# Altium project MicrophoneArray.PrjPcb
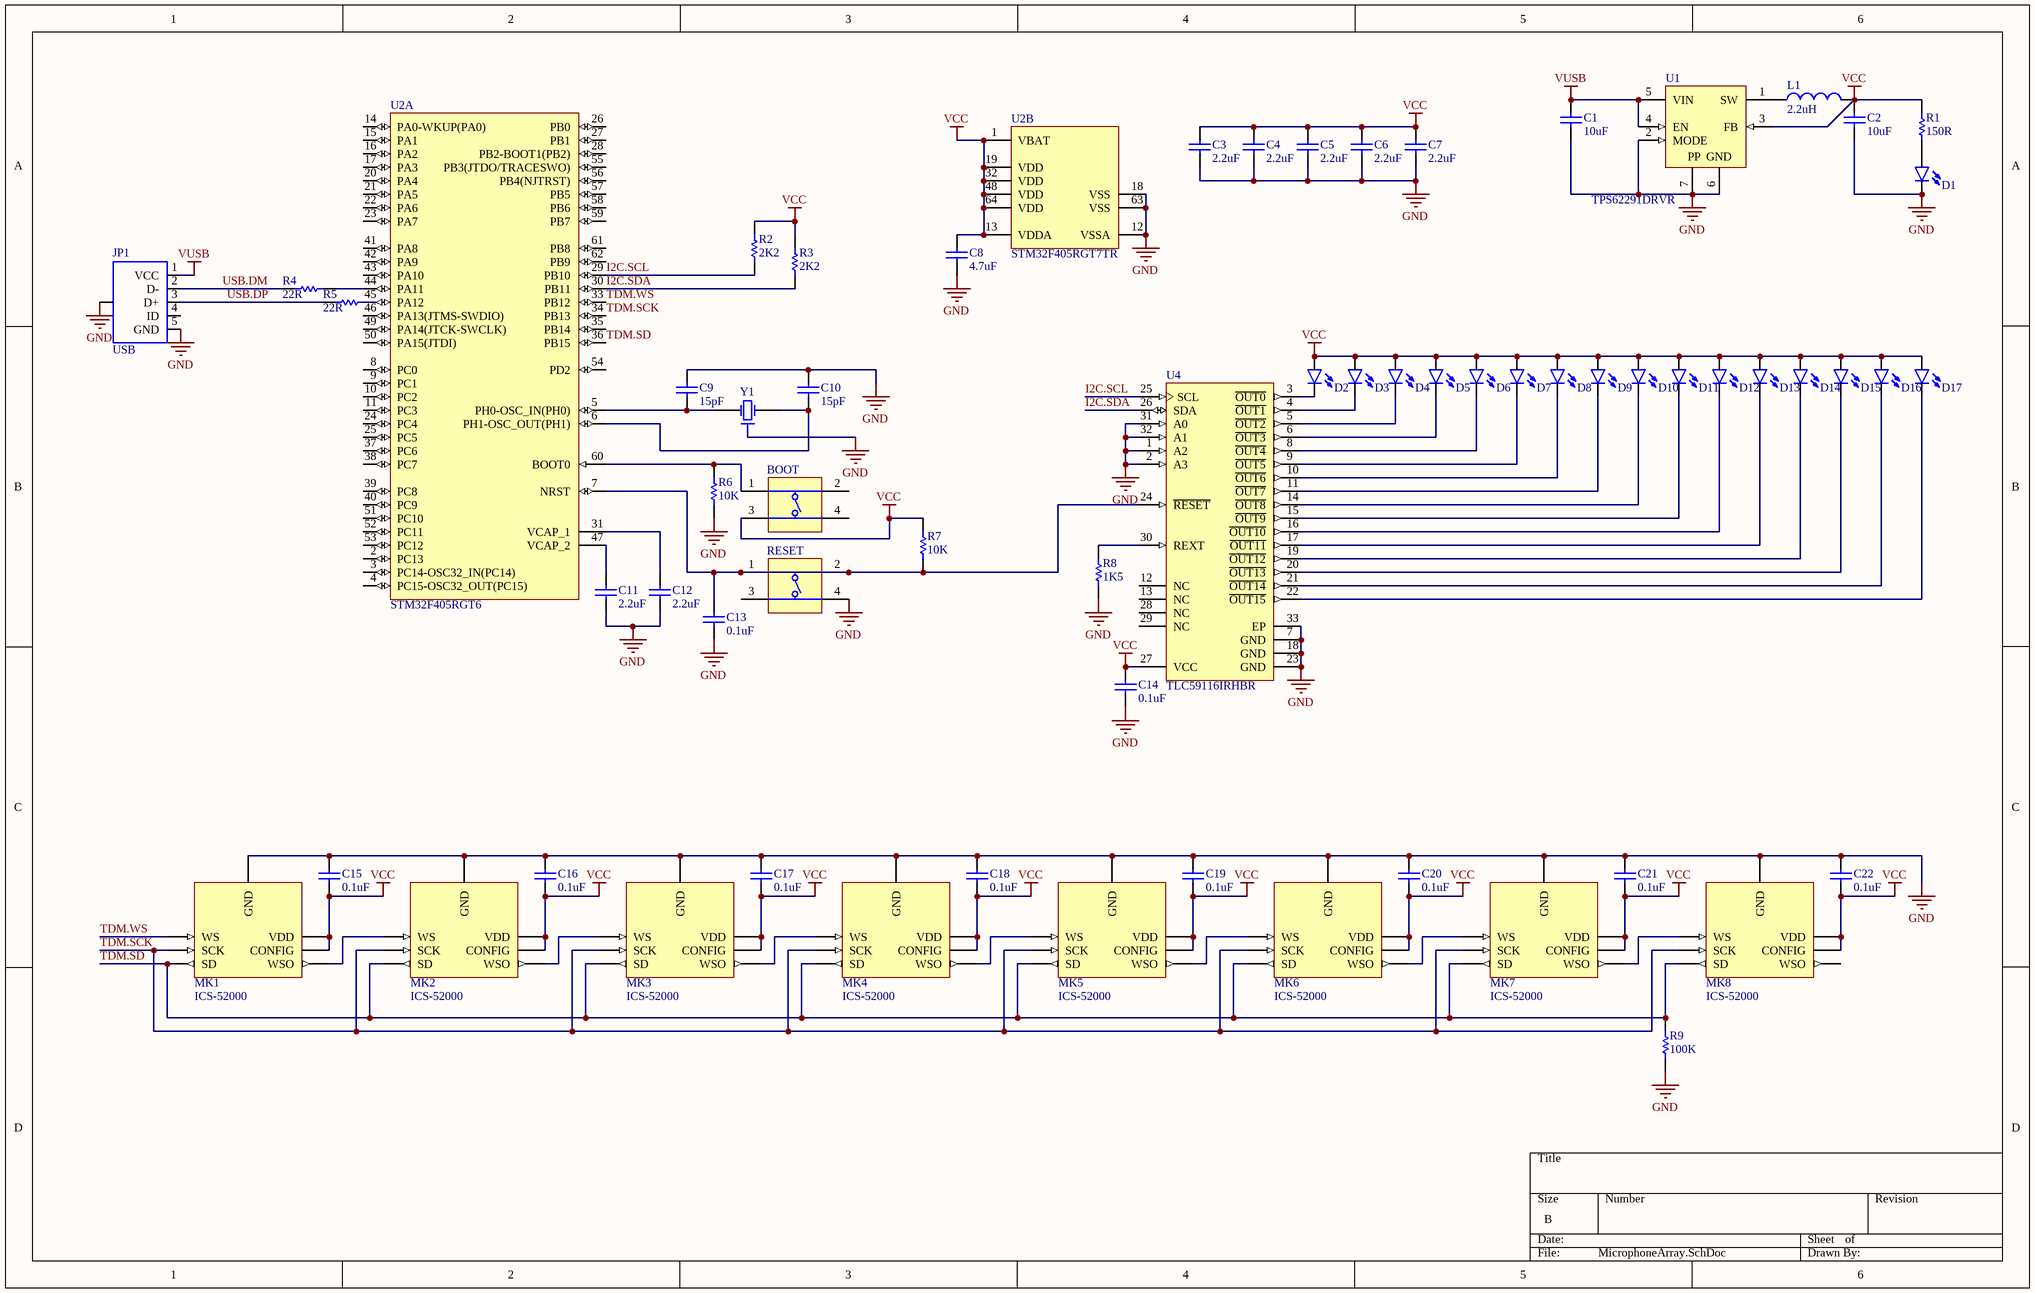
[diagram p0: MicrophoneArray.SchDoc]
1 sheet, 64 parts. Net scope: global (net labels, ports and power ports of the same name join across sheets).
Board file: MicrophoneArray.PcbDoc

## Sheet MicrophoneArray.SchDoc
size B

### Parts
BOOT  (no value)  [SWITCH]
C1  value 10uF  [C0402[1005X55]]  (hidden comment: 10uF 6.3V 0402)
C2  value 10uF  [C0402[1005X55]]  (hidden comment: 10uF 6.3V 0402)
C3  value 2.2uF  [C0402[1005X55]]  (hidden comment: 2.2uF 6.3V 0402)
C4  value 2.2uF  [C0402[1005X55]]  (hidden comment: 2.2uF 6.3V 0402)
C5  value 2.2uF  [C0402[1005X55]]  (hidden comment: 2.2uF 6.3V 0402)
C6  value 2.2uF  [C0402[1005X55]]  (hidden comment: 2.2uF 6.3V 0402)
C7  value 2.2uF  [C0402[1005X55]]  (hidden comment: 2.2uF 6.3V 0402)
C8  value 4.7uF  [C0402[1005X55]]  (hidden comment: 4.7uF 6.3V 0402)
C9  value 15pF  [C0402[1005X55]]  (hidden comment: 15pF 50V 0402)
C10  value 15pF  [C0402[1005X55]]  (hidden comment: 15pF 50V 0402)
C11  value 2.2uF  [C0402[1005X55]]  (hidden comment: 2.2uF 6.3V 0402)
C12  value 2.2uF  [C0402[1005X55]]  (hidden comment: 2.2uF 6.3V 0402)
C13  value 0.1uF  [C0402[1005X55]]  (hidden comment: 0.1uF 6.3V 0402)
C14  value 0.1uF  [C0402[1005X55]]  (hidden comment: 0.1uF 6.3V 0402)
C15  value 0.1uF  [C0402[1005X55]]  (hidden comment: 0.1uF 6.3V 0402)
C16  value 0.1uF  [C0402[1005X55]]  (hidden comment: 0.1uF 6.3V 0402)
C17  value 0.1uF  [C0402[1005X55]]  (hidden comment: 0.1uF 6.3V 0402)
C18  value 0.1uF  [C0402[1005X55]]  (hidden comment: 0.1uF 6.3V 0402)
C19  value 0.1uF  [C0402[1005X55]]  (hidden comment: 0.1uF 6.3V 0402)
C20  value 0.1uF  [C0402[1005X55]]  (hidden comment: 0.1uF 6.3V 0402)
C21  value 0.1uF  [C0402[1005X55]]  (hidden comment: 0.1uF 6.3V 0402)
C22  value 0.1uF  [C0402[1005X55]]  (hidden comment: 0.1uF 6.3V 0402)
D1  LED_0603_GREEN_5mA  [LED0603]  (value not drawn)
D2  LED_0603_BLUE_5mA  [LED0603]  (value not drawn)
D3  LED_0603_BLUE_5mA  [LED0603]  (value not drawn)
D4  LED_0603_BLUE_5mA  [LED0603]  (value not drawn)
D5  LED_0603_BLUE_5mA  [LED0603]  (value not drawn)
D6  LED_0603_BLUE_5mA  [LED0603]  (value not drawn)
D7  LED_0603_BLUE_5mA  [LED0603]  (value not drawn)
D8  LED_0603_BLUE_5mA  [LED0603]  (value not drawn)
D9  LED_0603_BLUE_5mA  [LED0603]  (value not drawn)
D10  LED_0603_BLUE_5mA  [LED0603]  (value not drawn)
D11  LED_0603_BLUE_5mA  [LED0603]  (value not drawn)
D12  LED_0603_BLUE_5mA  [LED0603]  (value not drawn)
D13  LED_0603_BLUE_5mA  [LED0603]  (value not drawn)
D14  LED_0603_BLUE_5mA  [LED0603]  (value not drawn)
D15  LED_0603_BLUE_5mA  [LED0603]  (value not drawn)
D16  LED_0603_BLUE_5mA  [LED0603]  (value not drawn)
D17  LED_0603_BLUE_5mA  [LED0603]  (value not drawn)
JP1  USB  [USB-MICROB]
L1  2.2uH  [IND0805]
MK1  ICS-52000  [MIC]
MK2  ICS-52000  [MIC]
MK3  ICS-52000  [MIC]
MK4  ICS-52000  [MIC]
MK5  ICS-52000  [MIC]
MK6  ICS-52000  [MIC]
MK7  ICS-52000  [MIC]
MK8  ICS-52000  [MIC]
R1  value 150R  [R0402[1005]]  (hidden comment: 150R 1% 0402)
R2  value 2K2  [R0402[1005]]  (hidden comment: 2K2 1% 0402)
R3  value 2K2  [R0402[1005]]  (hidden comment: 2K2 1% 0402)
R4  value 22R  [R0402[1005]]  (hidden comment: 22R 1% 0402)
R5  value 22R  [R0402[1005]]  (hidden comment: 22R 1% 0402)
R6  value 10K  [R0402[1005]]  (hidden comment: 10K 1% 0402)
R7  value 10K  [R0402[1005]]  (hidden comment: 10K 1% 0402)
R8  value 1K5  [R0402[1005]]  (hidden comment: 1K5 1% 0402)
R9  value 100K  [R0402[1005]]  (hidden comment: 100K 1% 0402)
RESET  (no value)  [SWITCH]
U1  TPS62291DRVR  [WSON-6]
U2  STM32F405RGT6  [STM-LQFP64_L]  (parts A,B of 2)
U4  TLC59116IRHBR  [RHB0032E_V]
Y1  (no value)  [ABRA-ABM3B-4_V]

### Nets
GND: C1.1 C2.1 C3.1 C4.1 C5.1 C6.1 C7.1 C8.1 C9.2 C10.2 C11.1 C12.1 C13.1 C14.1 C15.2 C16.2 C17.2 C18.2 C19.2 C20.2 C21.2 C22.2 D1.C JP1.5(GND) JP1.6(SHIELD) MK1.4(GND) MK2.4(GND) MK3.4(GND) MK4.4(GND) MK5.4(GND) MK6.4(GND) MK7.4(GND) MK8.4(GND) R6.1 R8.1 R9.1 RESET.4(T3) U1.2(MODE) U1.6(GND) U1.7(EP) U2.12(VSSA) U2.18(VSS) U2.63(VSS) U4.1(A2) U4.2(A3) U4.7(GND) U4.18(GND) U4.23(GND) U4.31(A0) U4.32(A1) U4.33(EP) Y1.2
VCC: BOOT.3(T3) C2.2 C3.2 C4.2 C5.2 C6.2 C7.2 C8.2 C14.2 C15.1 C16.1 C17.1 C18.1 C19.1 C20.1 C21.1 C22.1 D2.A D3.A D4.A D5.A D6.A D7.A D8.A D9.A D10.A D11.A D12.A D13.A D14.A D15.A D16.A D17.A L1.2 MK1.2(CONFIG) MK1.3(VDD) MK2.2(CONFIG) MK2.3(VDD) MK3.2(CONFIG) MK3.3(VDD) MK4.2(CONFIG) MK4.3(VDD) MK5.2(CONFIG) MK5.3(VDD) MK6.2(CONFIG) MK6.3(VDD) MK7.2(CONFIG) MK7.3(VDD) MK8.2(CONFIG) MK8.3(VDD) R1.2 R2.2 R3.2 R7.2 U1.3(FB) U2.1(VBAT) U2.13(VDDA) U2.19(VDD) U2.32(VDD) U2.48(VDD) U2.64(VDD) U4.27(VCC)
VUSB: C1.2 JP1.1(VCC) U1.4(EN) U1.5(VIN)
I2C.SCL: R2.1 U2.29(PB10) U4.25(SCL)
I2C.SDA: R3.1 U2.30(PB11) U4.26(SDA)
TDM.SCK: MK1.6(SCK) MK2.6(SCK) MK3.6(SCK) MK4.6(SCK) MK5.6(SCK) MK6.6(SCK) MK7.6(SCK) MK8.6(SCK) U2.34(PB13)
TDM.SD: MK1.7(SD) MK2.7(SD) MK3.7(SD) MK4.7(SD) MK5.7(SD) MK6.7(SD) MK7.7(SD) MK8.7(SD) R9.2 U2.36(PB15)
TDM.WS: MK1.5(WS) U2.33(PB12)
USB.DM: JP1.2(D-) R4.1
USB.DP: JP1.3(D+) R5.1
NetBOOT_1: BOOT.1(T1) R6.2 U2.60(BOOT0)
NetC9_1: C9.1 U2.5(PH0-OSC_IN(PH0)) Y1.3(X2)
NetC10_1: C10.1 U2.6(PH1-OSC_OUT(PH1)) Y1.1(X1)
NetC11_2: C11.2 U2.47(VCAP_2)
NetC12_2: C12.2 U2.31(VCAP_1)
NetC13_2: C13.2 R7.1 RESET.1(T1) RESET.2(T2) U2.7(NRST) U4.24(~{RESET})
NetD1_A: D1.A R1.1
NetD2_C: D2.C U4.3(~{OUT0})
NetD3_C: D3.C U4.4(~{OUT1})
NetD4_C: D4.C U4.5(~{OUT2})
NetD5_C: D5.C U4.6(~{OUT3})
NetD6_C: D6.C U4.8(~{OUT4})
NetD7_C: D7.C U4.9(~{OUT5})
NetD8_C: D8.C U4.10(~{OUT6})
NetD9_C: D9.C U4.11(~{OUT7})
NetD10_C: D10.C U4.14(~{OUT8})
NetD11_C: D11.C U4.15(~{OUT9})
NetD12_C: D12.C U4.16(~{OUT10})
NetD13_C: D13.C U4.17(~{OUT11})
NetD14_C: D14.C U4.19(~{OUT12})
NetD15_C: D15.C U4.20(~{OUT13})
NetD16_C: D16.C U4.21(~{OUT14})
NetD17_C: D17.C U4.22(~{OUT15})
NetL1_1: L1.1 U1.1(SW)
NetMK1_1: MK1.1(WSO) MK2.5(WS)
NetMK2_1: MK2.1(WSO) MK3.5(WS)
NetMK3_1: MK3.1(WSO) MK4.5(WS)
NetMK4_1: MK4.1(WSO) MK5.5(WS)
NetMK5_1: MK5.1(WSO) MK6.5(WS)
NetMK6_1: MK6.1(WSO) MK7.5(WS)
NetMK7_1: MK7.1(WSO) MK8.5(WS)
NetR4_2: R4.2 U2.44(PA11)
NetR5_2: R5.2 U2.45(PA12)
NetR8_2: R8.2 U4.30(REXT)

Not connected (* = marked no-connect by the designer): BOOT 2(T2) 4(T3); JP1 4(ID); MK8 1(WSO); RESET 3(T3); U2 2(PC13) 3(PC14-OSC32_IN(PC14)) 4(PC15-OSC32_OUT(PC15)) 8(PC0) 9(PC1) 10(PC2) 11(PC3) 14(PA0-WKUP(PA0)) 15(PA1) 16(PA2) 17(PA3) 20(PA4) 21(PA5) 22(PA6) 23(PA7) 24(PC4) 25(PC5) 26(PB0) 27(PB1) 28(PB2-BOOT1(PB2)) 35(PB14) 37(PC6) 38(PC7) 39(PC8) 40(PC9) 41(PA8) 42(PA9) 43(PA10) 46(PA13(JTMS-SWDIO)) 49(PA14(JTCK-SWCLK)) 50(PA15(JTDI)) 51(PC10) 52(PC11) 53(PC12) 54(PD2) 55(PB3(JTDO/TRACESWO)) 56(PB4(NJTRST)) 57(PB5) 58(PB6) 59(PB7) 61(PB8) 62(PB9); U4 12(NC) 13(NC) 28(NC) 29(NC)

### Notes on the sheet
- (in symbol TPS62291DRVR) PP

### Library data of the parts
BOOT RESET = DIPT-DTSM-6: Switch, SPNO Push Button SMD; Manufacturer: C&K Components; PartNumber: PTS810 SJM 250 SMTR LFS; Packing Type: Tape&Reel; Mechanical Life: 200,000 cycles; ComponentLink2URL: http://www.dip.com.tw/Products_tact.htm; ComponentLink1URL: http://www.dip.com.tw/; ComponentLink3URL: http://www.dip.com.tw/PDF/pro_tact/DTSM_G_-6_2_-V.pdf; PackageDescription: Switch, Surface Mount, 4 Leads, Body 4.6x2.8mm, Height 1.9mm; ComponentLink2Description: Datasheet; ComponentLink3Description: Package Specification; ComponentLink1Description: Manufacturer URL; PackageReference: PTS810; Mounting Technology: Surface Mount
C1 C2 = CAP_10uF_6.3V_0402_20%: 10uF 6.3V 20% 0402 (1005 Metric); PartNumber: GRM155R60J106ME44D; Manufacturer: Murata; Tolerance: 20%; Mounting Technology: Surface Mount; PackageReference: 0402; PackageDescription: 0402 (1005 Metric); Voltage: 6.3V
C3-C7 C11 C12 = CAP_2.2uF_6.3V_0402_20%: 2.2uF 6.3V 20% 0402 (1005 Metric); PartNumber: GRM155R60J225ME15D; Manufacturer: Murata; Tolerance: 20%; Mounting Technology: Surface Mount; PackageReference: 0402; PackageDescription: 0402 (1005 Metric); Voltage: 6.3V
C8 = CAP_4.7uF_6.3V_0402_20%: 4.7uF 6.3V 20% 0402 (1005 Metric); PartNumber: GRM155R60J475ME47D; Manufacturer: Murata; Tolerance: 20%; Mounting Technology: Surface Mount; PackageReference: 0402; PackageDescription: 0402 (1005 Metric); Voltage: 6.3V
C9 C10 = CAP_15pF_50V_0402_5%: 15pF 50V 5% 0402 (1005 Metric); PartNumber: GRM1555C1H150JA01D; Manufacturer: Murata; Tolerance: 5%; Mounting Technology: Surface Mount; PackageReference: 0402; PackageDescription: 0402 (1005 Metric); Voltage: 50V
C13-C22 = CAP_0.1uF_6.3V_0402_10%: 0.1uF 6.3V 10% 0402 (1005 Metric); PartNumber: GRM155R70J104KA01D; Manufacturer: Murata; Tolerance: 10%; Mounting Technology: Surface Mount; PackageReference: 0402; PackageDescription: 0402 (1005 Metric); Voltage: 6.3V
D1 = LED_0603_GREEN_5mA: PartNumber: LTST-C193TGKT-5A; Manufacturer: Lite-On Inc.; PackageReference: 0603; PackageDescription: 0603 (1608 Metric); Mounting Technology: Surface Mount
D2-D17 = LED_0603_BLUE_5mA: PartNumber: LTST-C193TBKT-5A; Manufacturer: Lite-On Inc.; PackageReference: 0603; PackageDescription: 0603 (1608 Metric); Mounting Technology: Surface Mount
JP1 = USB_MICROB_SMT: pin to pad: 1>VBUS 2>D- 3>D+ 4>ID 5>GND 6>MT1+P$1+P$2+MT2; PartNumber: 10118192-0001LF; Manufacturer: Amphenol FCI; Mounting Technology: Surface Mount; PackageReference: USB - Micro B
L1 = IND_2.2uH_1.7A_0805_20%: 2.2uH 20% 1.7A 0805; PartNumber: LQM21PN2R2MGHL; Manufacturer: Murata; PackageReference: 0805; PackageDescription: 0805 (2012 metric); Value: 2.2uH; Mounting Technology: Surface Mount; Current: 1.7A
MK1-MK8 = ICS-52000: MIC MEMS DIGITAL OMNI -26DB; Manufacturer: TDK InvenSense; PartNumber: ICS-52000; Mounting Technology: Surface Mount
R1 = RES_150R_0402_1%: 150R 0.063W 1% 0402 (1005 Metric); Manufacturer: KOA Speer; PartNumber: RK73H1ETTP1500F; Tolerance: 1%; Power: 0.063W; Mounting Technology: Surface Mount; PackageReference: 0402; PackageDescription: 0402 (1005 Metric); ComponentLink1Description: Datasheet; ComponentLink1URL: http://www.koaspeer.com/catimages/Products/RK73H/RK73H.pdf
R2 R3 = RES_2K2_0402_1%: 2K2 0.063W 1% 0402 (1005 Metric); Manufacturer: KOA Speer; PartNumber: RK73H1ETTP2201F; Tolerance: 1%; Power: 0.063W; Mounting Technology: Surface Mount; PackageReference: 0402; PackageDescription: 0402 (1005 Metric); ComponentLink1Description: Datasheet; ComponentLink1URL: http://www.koaspeer.com/catimages/Products/RK73H/RK73H.pdf
R4 R5 = RES_22R_0402_1%: 22R 0.063W 1% 0402 (1005 Metric); Manufacturer: KOA Speer; PartNumber: RK73H1ETTP22R0F; Power: 0.063W; Tolerance: 1%; Mounting Technology: Surface Mount; PackageReference: 0402; PackageDescription: 0402 (1005 Metric); ComponentLink1Description: Datasheet; ComponentLink1URL: http://www.koaspeer.com/catimages/Products/RK73H/RK73H.pdf
R6 R7 = RES_10K_0402_1%: 10K 0.063W 1% 0402 (1005 Metric); Manufacturer: KOA Speer; PartNumber: RK73H1ETTP1002F; Tolerance: 1%; Power: 0.063W; Mounting Technology: Surface Mount; PackageReference: 0402; PackageDescription: 0402 (1005 Metric); ComponentLink1Description: Datasheet; ComponentLink1URL: http://www.koaspeer.com/catimages/Products/RK73H/RK73H.pdf
R8 = RES_1K5_0402_1%: 1K5 0.063W 1% 0402 (1005 Metric); Manufacturer: KOA Speer; PartNumber: RK73H1ETTP1501F; Tolerance: 1%; Power: 0.063W; Mounting Technology: Surface Mount; PackageReference: 0402; PackageDescription: 0402 (1005 Metric); ComponentLink1Description: Datasheet; ComponentLink1URL: http://www.koaspeer.com/catimages/Products/RK73H/RK73H.pdf
R9 = RES_100K_0402_1%: 100K 0.063W 1% 0402 (1005 Metric); Manufacturer: KOA Speer; PartNumber: RK73H1ETTP1003F; Tolerance: 1%; Power: 0.063W; Mounting Technology: Surface Mount; PackageReference: 0402; PackageDescription: 0402 (1005 Metric); ComponentLink1Description: Datasheet; ComponentLink1URL: http://www.koaspeer.com/catimages/Products/RK73H/RK73H.pdf
U1 = TPS62291DRVR: Voltage Regulators - Switching Regulators 2.25MHz 1A Step-Down Cnvrtr 3.3V Output; Manufacturer: Texas Instruments; PartNumber: TPS62291DRVR; PackageReference: WSON-6; PackageDescription: SON, 6-Leads, Body 2x2mm, Pitch 0.65mm, Thermal Pad 1.6x1mm, TI Recommended; Mounting Technology: Surface Mount
U2 = CMP-0243-00089-2: ARM Cortex-M4 32-bit MCU+FPU, 210 DMIPS, 1024 kB Flash, 192 kB Internal RAM, 51 I/Os, 64-pin LQFP, -40 to 105 degC, Tape and Reel; Manufacturer: STMicroelectronics; FLASH Size (Prog) (kB): 1024; Supply Voltage(Vcc) max (V): 3.6; Internal RAM Size (kB): 192; Supply Voltage(Vcc) min (V): 1.8; Operating Frequency(F) (Processor speed) (MHz): 168; D/A Converter: 2x12-bit; I/Os (High Current): 51; ComponentLink2Description: Datasheet; Core: ARM Cortex-M4; PackageVersion: Rev. 4, 06/2013; ComponentLink1URL: http://www.st.com/web/en/home.html; PackageReference: LQFP64; Mounting Technology: Surface Mount; ComponentLink1Description: Manufacturer URL; PackageDescription: 64-Pin Low Profile Quad Flat Package, 10 x 10 mm Body, 0.5 mm Pitch; ComponentLink3Description: Package Specification; ComponentLink2URL: http://www.st.com/st-web-ui/static/active/en/resource/technical/document/datasheet/DM00037051.pdf; PartNumber: STM32F405RGT6; ComponentLink3URL: http://www.st.com/st-web-ui/static/active/en/resource/technical/document/datasheet/DM00037051.pdf; Packing: Tape and Reel; DatasheetVersion: Rev. 4; PartId: 1
U4 = CMP-0388-00633-2: 16-Bit Fast-Mode Plus (FM+) I2C Bus Constant-Current LED Sink Driver, 3 to 5.5 V, -40 to 85 degC, 32-pin QFN (RHB32), Green (RoHS & no Sb/Br); Manufacturer: Texas Instruments; SubFamily: LED Driver; Vin(Min)(V): 3; Rating: Catalog; Vin(Max)(V): 5.5; Mounting Technology: Surface Mount; DatasheetVersion: SLDS157D; ComponentLink3Description: Package Specification; ComponentLink2URL: http://www.ti.com/general/docs/lit/getliterature.tsp?genericPartNumber=TLC59116&fileType=pdf; Eco-Plan: Green (RoHS & no Sb/Br); ComponentLink3URL: http://www.ti.com/lit/ml/mpqf130c/mpqf130c.pdf; ComponentLink1Description: Manufacturer URL; PackageReference: RHB0032E; PartNumber: TLC59116IRHBR; Code_JEDEC: MO-220; ComponentLink1URL: http://www.ti.com/; PackageDescription: 32-Pin Plastic Flat Pack, Body 5 x 5 mm, Pitch 0.5 mm; PackageVersion: 4204326/D; ComponentLink2Description: Datasheet
Y1 = ABRA-ABM3B-4: PartNumber: ABM3B-8.000MHZ-10-1UT; Manufacturer: ABRACON; Mounting Technology: Surface Mount; PackageReference: 2012; PackageDescription: 2012 (5032 metric)